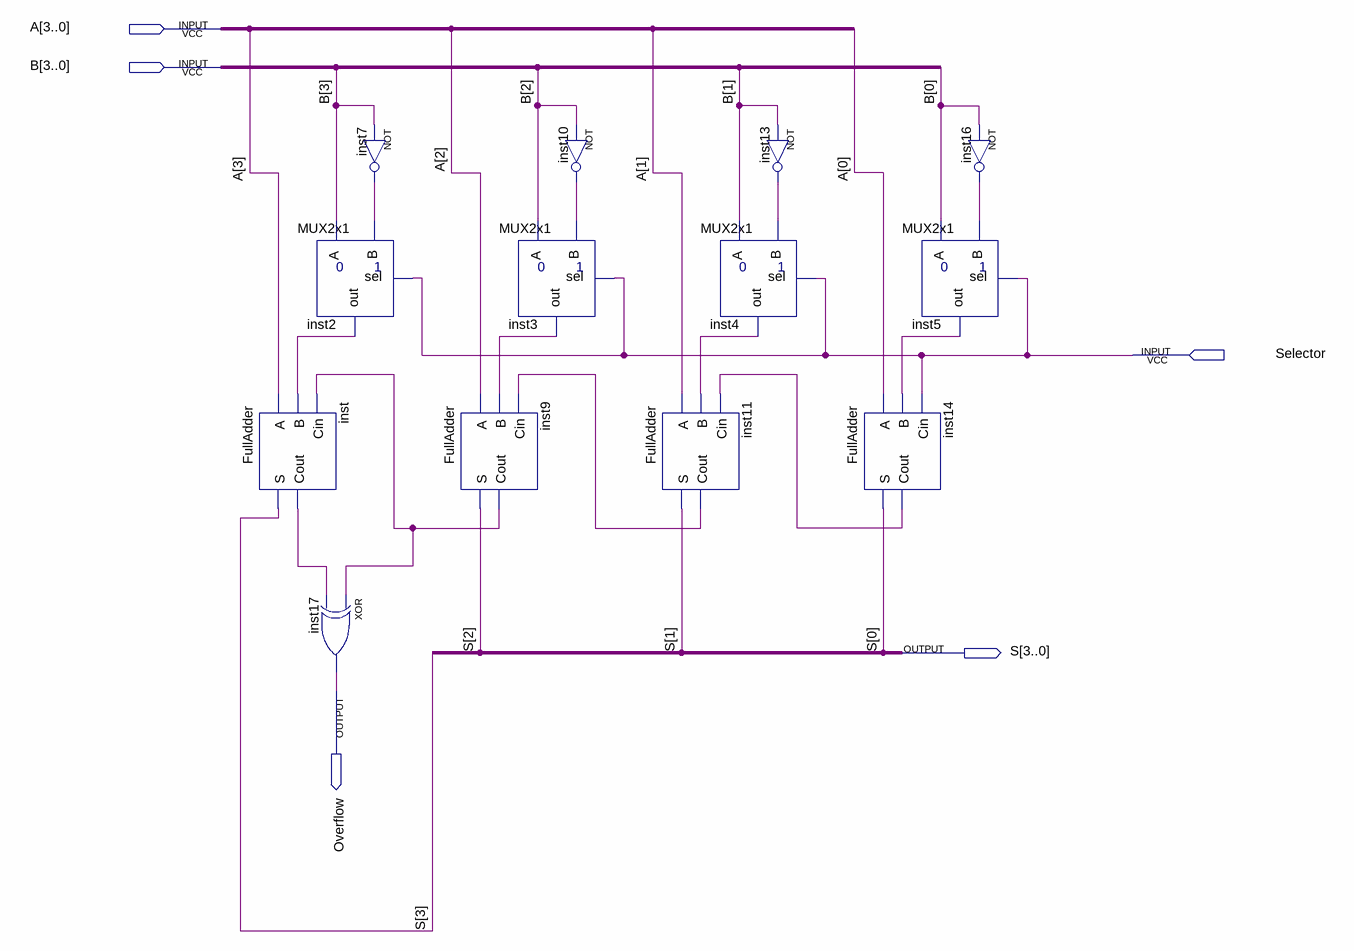
[diagram p0: schematic sheet]
// Quartus schematic Somador.bdf as structural Verilog: 13 symbols, 5 pins
module Somador (
  input  [3:0] A,
  input  [3:0] B,
  input  Selector,
  output [3:0] S,
  output Overflow
);

  wire inst2_out, inst3_out, inst4_out, inst5_out, inst7_out, inst9_cout, inst10_out, inst11_cout,
       inst13_out, inst14_cout, inst16_out, inst_cout;

  FullAdder inst (.A(A[3]), .B(inst2_out), .Cin(inst9_cout), .S(S[3]), .Cout(inst_cout));
  not inst7 (inst7_out, B[3]);
  MUX2x1 inst2 (.A(B[3]), .B(inst7_out), .sel(Selector), .out(inst2_out));
  xor inst17 (Overflow, inst9_cout, inst_cout);
  FullAdder inst9 (.A(A[2]), .B(inst3_out), .Cin(inst11_cout), .S(S[2]), .Cout(inst9_cout));
  MUX2x1 inst3 (.A(B[2]), .B(inst10_out), .sel(Selector), .out(inst3_out));
  not inst10 (inst10_out, B[2]);
  FullAdder inst11 (.A(A[1]), .B(inst4_out), .Cin(inst14_cout), .S(S[1]), .Cout(inst11_cout));
  MUX2x1 inst4 (.A(B[1]), .B(inst13_out), .sel(Selector), .out(inst4_out));
  not inst13 (inst13_out, B[1]);
  MUX2x1 inst5 (.A(B[0]), .B(inst16_out), .sel(Selector), .out(inst5_out));
  FullAdder inst14 (.A(A[0]), .B(inst5_out), .Cin(Selector), .S(S[0]), .Cout(inst14_cout));
  not inst16 (inst16_out, B[0]);
endmodule
